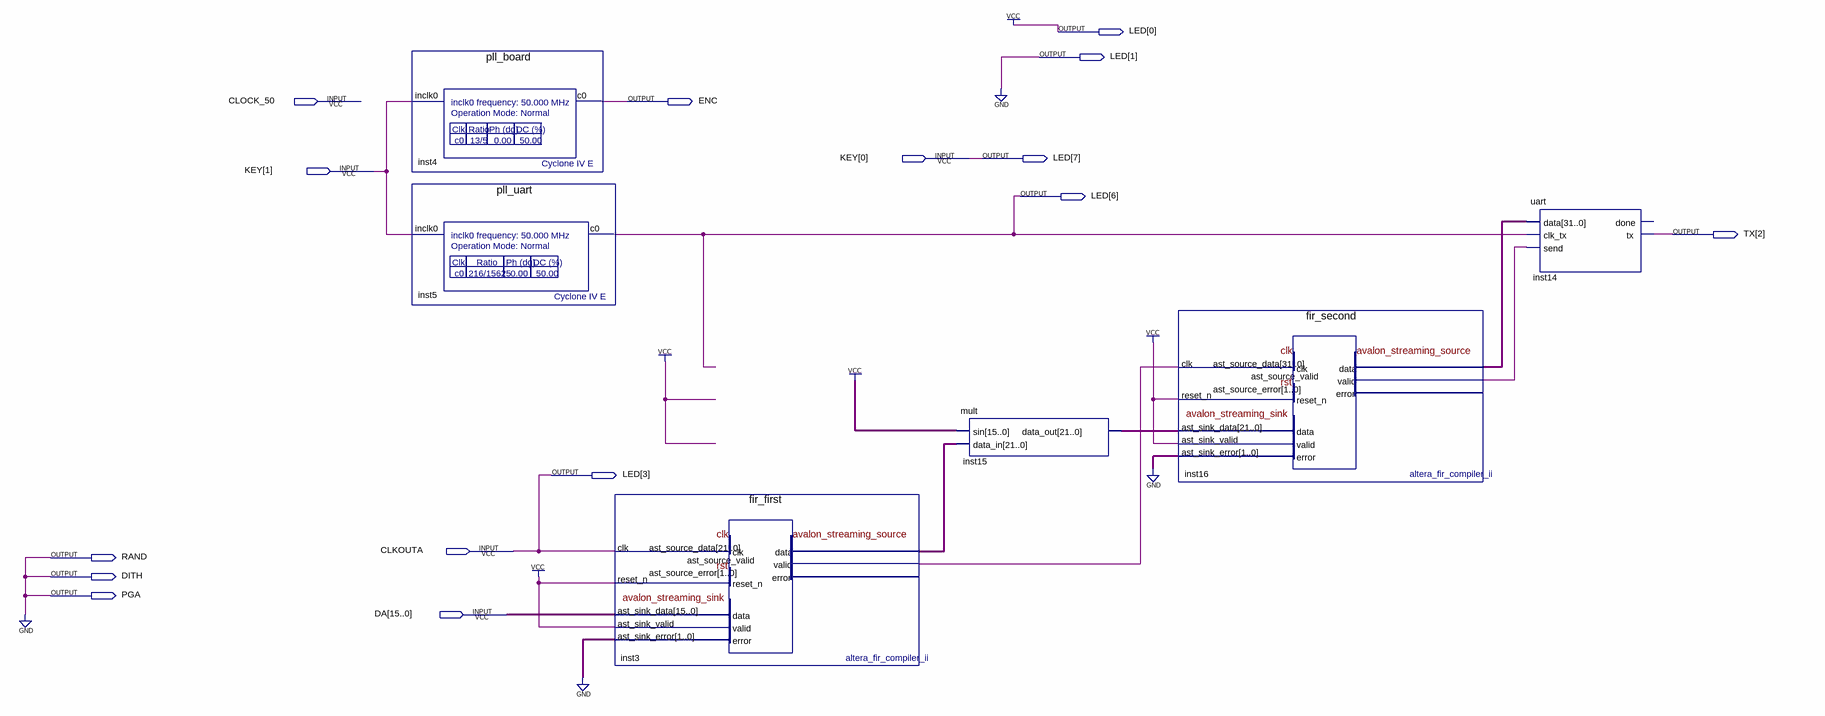
[diagram p0: schematic sheet]
// Quartus schematic receiver_diag.bdf as structural Verilog: 6 symbols, 15 pins
module receiver_diag (
  input  CLOCK_50,
  input  [1:0] KEY,
  input  CLKOUTA,
  input  [15:0] DA,
  output [7:0] LED,
  output ENC,
  output [2:2] TX,
  output RAND,
  output DITH,
  output PGA
);

  wire inst3_ast_source_valid, inst16_ast_source_valid;
  wire [21:0] inst3_ast_source_data, inst15_data_out;
  wire [31:0] inst16_ast_source_data;

  pll_board inst4 (.inclk0(KEY[1]), .c0(ENC));
  pll_uart inst5 (.inclk0(KEY[1]), .c0(LED[6]));
  fir_first inst3 (
    .clk(CLKOUTA), .reset_n(1'b1), .ast_sink_data(DA), .ast_sink_valid(1'b1), .ast_sink_error(2'b00),
    .ast_source_data(inst3_ast_source_data), .ast_source_valid(inst3_ast_source_valid));  // open: ast_source_error
  mult inst15 (.sin({16{1'b1}}), .data_in(inst3_ast_source_data), .data_out(inst15_data_out));
  fir_second inst16 (
    .clk(inst3_ast_source_valid), .reset_n(1'b1), .ast_sink_data(inst15_data_out), .ast_sink_valid(1'b1),
    .ast_sink_error(2'b00), .ast_source_data(inst16_ast_source_data),
    .ast_source_valid(inst16_ast_source_valid));  // open: ast_source_error
  uart inst14 (
    .data(inst16_ast_source_data), .clk_tx(LED[6]), .send(inst16_ast_source_valid), .tx(TX[2]));  // open: done

  assign DITH = 1'b0;
  assign {LED[7], LED[3], LED[1:0]} = {KEY[0], CLKOUTA, 2'b01};
  assign PGA = 1'b0;
  assign RAND = 1'b0;
endmodule
